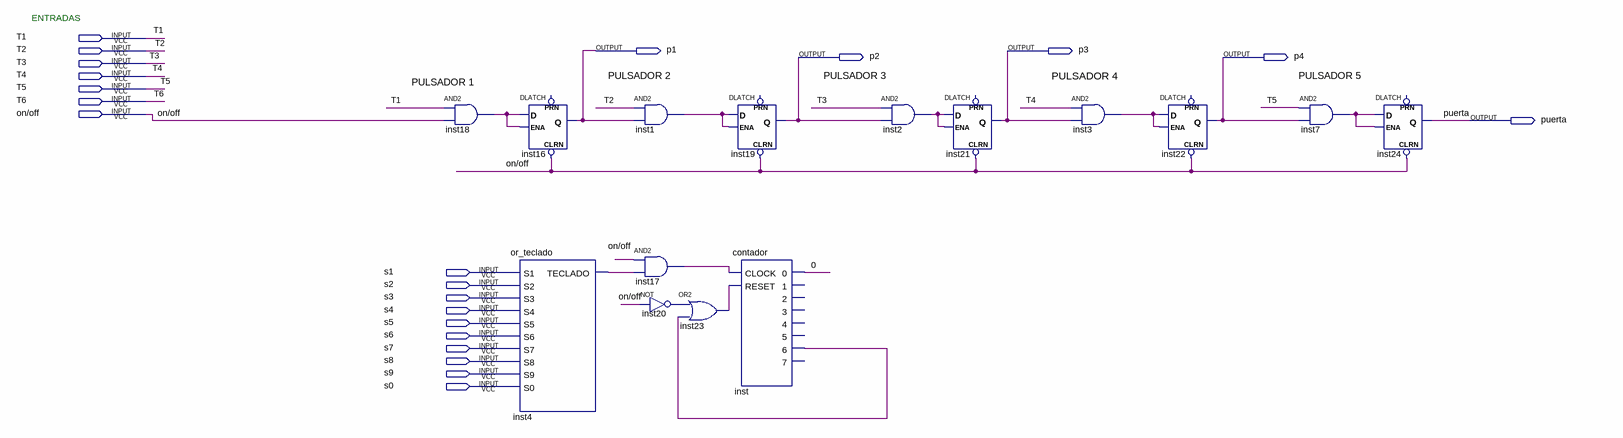
[diagram p0: schematic sheet]
// Quartus schematic definitivo.bdf as structural Verilog: 15 symbols, 22 pins
module definitivo (
  input  T1,
  input  T2,
  input  T3,
  input  T4,
  input  T5,
  input  T6,
  input  \on/off ,
  input  s1,
  input  s2,
  input  s3,
  input  s4,
  input  s5,
  input  s6,
  input  s7,
  input  s8,
  input  s9,
  input  s0,
  output p1,
  output p3,
  output p2,
  output p4,
  output puerta
);

  wire \0 , inst1_out, inst2_out, inst3_out, inst4_teclado, inst7_out, inst17_out, inst18_out, inst20_out,
       inst23_out, inst_6;

  and inst18 (inst18_out, T1, \on/off );
  or_teclado inst4 (.TECLADO(inst4_teclado));  // open: S1, S2, S3, S4, S5, S6, S7, S8, S9, S0
  DLATCH inst16 (.CLRN(\on/off ), .D(inst18_out), .ENA(inst18_out), .Q(p1));  // open: PRN
  and inst1 (inst1_out, T2, p1);
  and inst17 (inst17_out, \on/off , inst4_teclado);
  not inst20 (inst20_out, \on/off );
  or inst23 (inst23_out, inst20_out, inst_6);
  DLATCH inst19 (.CLRN(\on/off ), .D(inst1_out), .ENA(inst1_out), .Q(p2));  // open: PRN
  contador inst (.CLOCK(inst17_out), .RESET(inst23_out), .\0 (\0 ), .\6 (inst_6));  // open: 1, 2, 3, 4, 5, 7
  and inst2 (inst2_out, T3, p2);
  DLATCH inst21 (.CLRN(\on/off ), .D(inst2_out), .ENA(inst2_out), .Q(p3));  // open: PRN
  and inst3 (inst3_out, T4, p3);
  DLATCH inst22 (.CLRN(\on/off ), .D(inst3_out), .ENA(inst3_out), .Q(p4));  // open: PRN
  and inst7 (inst7_out, T5, p4);
  DLATCH inst24 (.CLRN(\on/off ), .D(inst7_out), .ENA(inst7_out), .Q(puerta));  // open: PRN

  // Notes on the sheet:
  //   ENTRADAS
  //   PULSADOR 2
  //   PULSADOR 3
  //   PULSADOR 4
  //   PULSADOR 5
  //   PULSADOR 1
endmodule
